# EAGLE schematic accBoard (EAGLE 6.1)
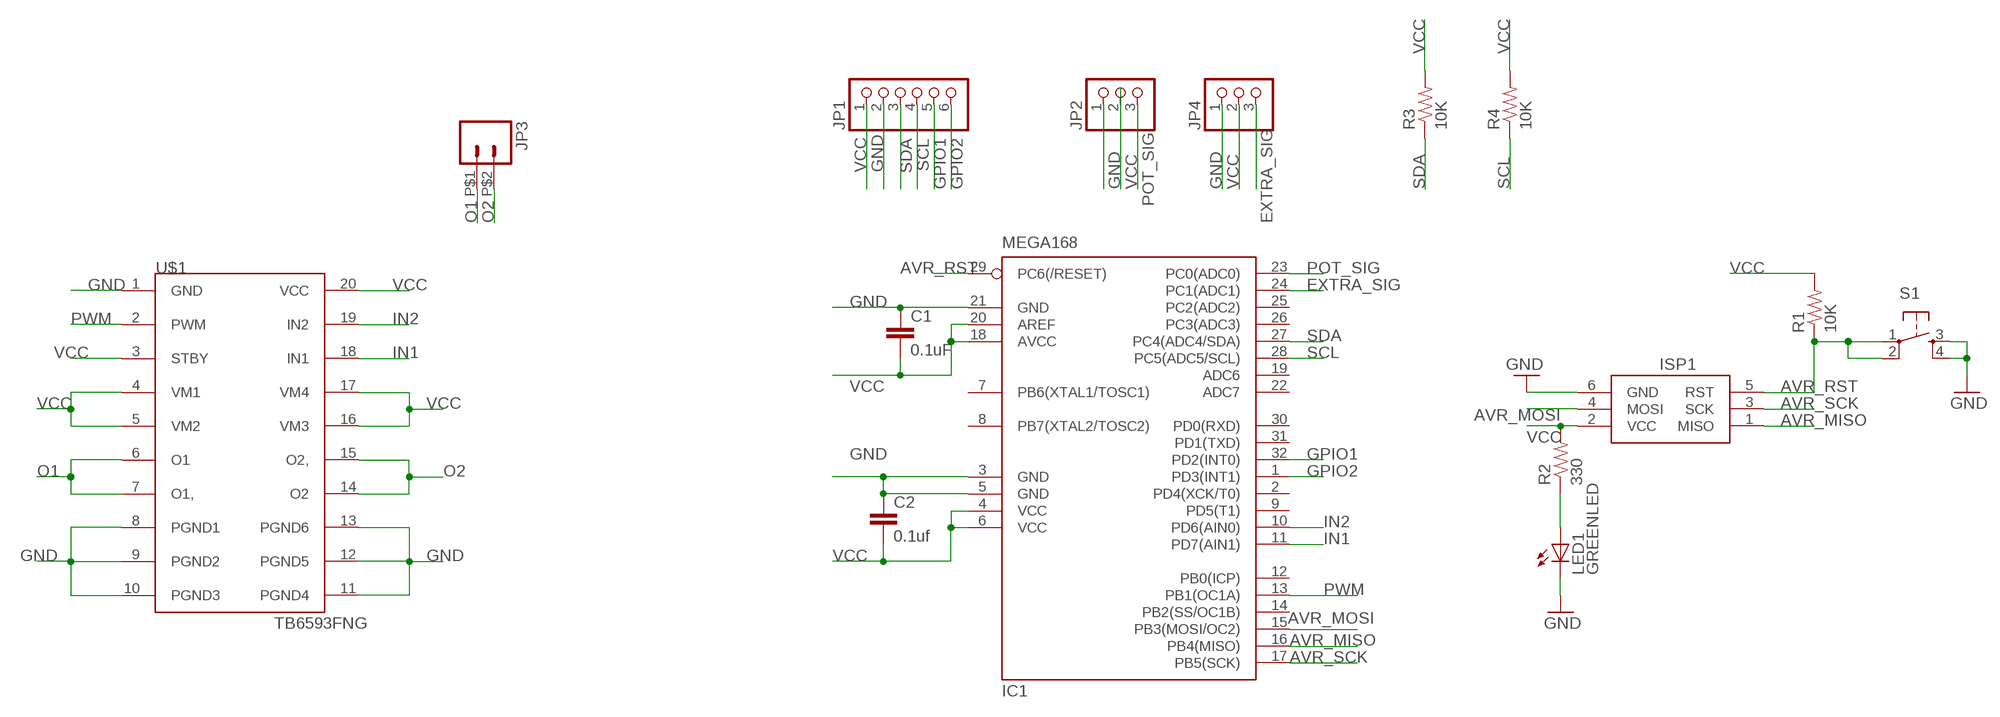
[diagram p0: schematic, sheet 1]

## Parts
C1  0.1uF  CAP0603-CAP  [0603-CAP]
C2  0.1uf  CAP0603-CAP  [0603-CAP]
IC1  MEGA168  MEGA8-AI  [TQFP32-08]
ISP1  AVRISP-6  [AVRISP]
JP1  PINHD-1X6  [1X06]
JP2  PINHD-1X3  [1X03]
JP3  M02PTH2  [1X02_BIG]
JP4  PINHD-1X3  [1X03]
LED1  GREENLED  LED0603  [LED-0603]
R1  10K  RESISTOR0603-RES  [0603-RES]
R2  330  RESISTOR0603-RES  [0603-RES]
R3  10K  RESISTOR0603-RES  [0603-RES]
R4  10K  RESISTOR0603-RES  [0603-RES]
S1  TAC_SWITCHSMD  [TACTILE_SWITCH_SMD]
U$1  TB6593FNG  [SSOP20]

## Nets
AVR_MISO: IC1.16(PB4(MISO)) ISP1.1(MISO)
AVR_MOSI: IC1.15(PB3(MOSI/OC2)) ISP1.4(MOSI)
AVR_RST: IC1.29(PC6(/RESET)) ISP1.5(RST) R1.1 S1.1 S1.2
AVR_SCK: IC1.17(PB5(SCK)) ISP1.3(SCK)
EXTRA_SIG: IC1.24(PC1(ADC1)) JP4.3
GND: C1.1 C2.1 IC1.3(GND) IC1.5(GND) IC1.21(GND) ISP1.6(GND) JP1.2 JP2.1 JP4.1 LED1.C S1.3 S1.4 U$1.1(GND) U$1.8(PGND1) U$1.9(PGND2) U$1.10(PGND3) U$1.11(PGND4) U$1.12(PGND5) U$1.13(PGND6)
GPIO1: IC1.32(PD2(INT0)) JP1.5
GPIO2: IC1.1(PD3(INT1)) JP1.6
IN1: IC1.11(PD7(AIN1)) U$1.18(IN1)
IN2: IC1.10(PD6(AIN0)) U$1.19(IN2)
N$2: LED1.A R2.1
O1: JP3.P$1 U$1.6(O1) U$1.7(O1,)
O2: JP3.P$2 U$1.14(O2) U$1.15(O2,)
POT_SIG: IC1.23(PC0(ADC0)) JP2.3
PWM: IC1.13(PB1(OC1A)) U$1.2(PWM)
SCL: IC1.28(PC5(ADC5/SCL)) JP1.4 R4.1
SDA: IC1.27(PC4(ADC4/SDA)) JP1.3 R3.1
VCC: C1.2 C2.2 IC1.4(VCC) IC1.6(VCC) IC1.18(AVCC) IC1.20(AREF) ISP1.2(VCC) JP1.1 JP2.2 JP4.2 R1.2 R2.2 R3.2 R4.2 U$1.3(STBY) U$1.4(VM1) U$1.5(VM2) U$1.16(VM3) U$1.17(VM4) U$1.20(VCC)
Unconnected: IC1.2(PD4(XCK/T0)) IC1.7(PB6(XTAL1/TOSC1)) IC1.8(PB7(XTAL2/TOSC2)) IC1.9(PD5(T1)) IC1.12(PB0(ICP)) IC1.14(PB2(SS/OC1B)) IC1.19(ADC6) IC1.22(ADC7) IC1.25(PC2(ADC2)) IC1.26(PC3(ADC3)) IC1.30(PD0(RXD)) IC1.31(PD1(TXD))

## Library data of the parts
C1 C2 = SparkFun:CAP: Capacitor Standard 0603 ceramic capacitor, and 0.1" leaded capacitor.
IC1 = atmel:MEGA8: MICROCONTROLLER 8 Kbytes FLASH, 1 kbytes SRAM, 512 bytes EEPROM, USART, 6-channel 10 bit ADC, 2-channel 8 bit ADC Pin compatible with Atmega48, ATMega88, ATMega168 Source: avr.lbr; MPN: ATMEGA8-16AU; OC_FARNELL: 9171371; OC_NEWARK: 73M8863
ISP1 = adafruit:AVRISP: AVR ISP HEADER Standard 6 pin header for AVR programming
JP1 = adafruit:PINHD-1X6: PIN HEADER
JP2 JP4 = adafruit:PINHD-1X3: PIN HEADER
JP3 = SparkFun:M02: Header 2 Standard 2-pin 0.1" header. Use with straight break away headers (SKU : PRT-00116), right angle break away headers (PRT-00553), swiss pins (PRT-00743), machine pins (PRT-00117), and female headers (PRT-00115). Molex polarized connector foot print use with SKU : PRT-08233 with associated crimp pins and housings.
LED1 = SparkFun:LED: LEDs Standard schematic elements and footprints for 5mm, 3mm, 1206, and 0603 sized LEDs. 5mm - Spark Fun Electronics SKU : COM-00529 (and others)
R1-R4 = SparkFun:RESISTOR: Resistor Basic schematic elements and footprints for 0603, 1206, and PTH 1/10th watt (small) resistors.
S1 = SparkFun:TAC_SWITCH: Momentary Switch Button commonly used for reset or general input. Spark Fun Electronics SKU : COM-00097
U$1 = jabinder:TB6593FNG